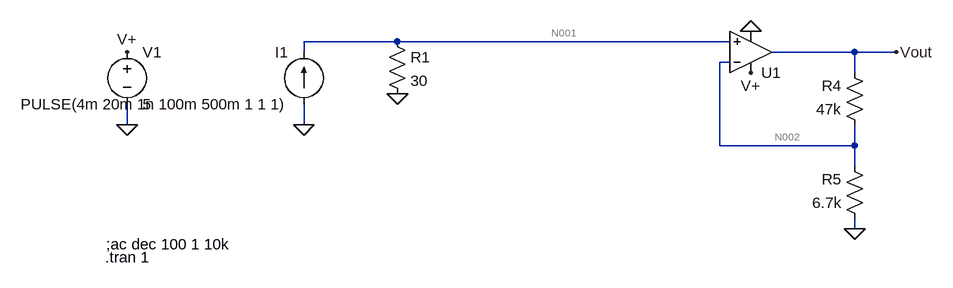
[diagram p0: schematic PT_sim.asc]
PT_sim.asc, the LTspice schematic file:
Version 4
SHEET 1 880 680
WIRE 32 112 -112 112
WIRE 544 112 32 112
WIRE -112 128 -112 112
WIRE 736 128 608 128
WIRE 800 128 736 128
WIRE 544 144 528 144
WIRE 736 160 736 128
WIRE -384 240 -384 208
WIRE -112 240 -112 208
WIRE 528 272 528 144
WIRE 736 272 736 240
WIRE 736 272 528 272
WIRE 736 304 736 272
WIRE 736 400 736 384
FLAG 736 400 0
FLAG 800 128 Vout
FLAG -112 240 0
FLAG -384 240 0
FLAG -384 128 V+
FLAG 576 160 V+
FLAG 576 96 0
FLAG 32 192 0
SYMBOL res 752 256 R180
WINDOW 0 36 76 Left 2
WINDOW 3 36 40 Left 2
SYMATTR InstName R4
SYMATTR Value 47k
SYMBOL res 752 400 R180
WINDOW 0 36 76 Left 2
WINDOW 3 36 40 Left 2
SYMATTR InstName R5
SYMATTR Value 6.7k
SYMBOL OpAmps\\UniversalOpAmp2 576 128 M180
SYMATTR InstName U1
SYMBOL voltage -384 112 R0
WINDOW 123 0 0 Left 0
WINDOW 39 0 0 Left 0
SYMATTR InstName V1
SYMATTR Value 5
SYMBOL current -112 208 R180
WINDOW 0 24 80 Left 2
WINDOW 3 24 0 Left 2
WINDOW 123 0 0 Left 0
WINDOW 39 0 0 Left 0
SYMATTR InstName I1
SYMATTR Value PULSE(4m 20m 1n 100m 500m 1 1 1)
SYMBOL res 16 96 R0
SYMATTR InstName R1
SYMATTR Value 30
TEXT -416 424 Left 2 !;ac dec 100 1 10k
TEXT -418 444 Left 2 !.tran 1

The netlist it stands for:
* PT_sim.asc
R4 N002 Vout 47k
R5 0 N002 6.7k
XU1 N001 N002 V+ 0 Vout level2 Avol=1Meg GBW=10Meg Slew=10Meg Ilimit=25m Rail=0 Vos=0 En=0 Enk=0 In=0 Ink=0 Rin=500Meg  ; pins In+ In- V+ V- OUT
V1 V+ 0 5
I1 0 N001 PULSE(4m 20m 1n 100m 500m 1 1 1)
R1 N001 0 30
;ac dec 100 1 10k
.tran 1
.lib UniversalOpAmp2.lib
.backanno
.end

* Results of the author's LTspice run, read from the files saved beside the schematic
* Operating Point, zero values left out:
*   V(n002) = 120 mV
*   V(vout) = 961.6 mV
*   V(v+) = 5 V
*   V(n001) = 120 mV
*   I(I1) = 4 mA
*   I(R4) = -17.91 µA
*   I(R5) = -17.91 µA
*   I(R1) = 4 mA
*   I(V1) = -206.2 µA
*   Ix(u1:1) = -4.76 nA
*   Ix(u1:2) = -4.76 nA
*   Ix(u1:3) = 206.2 µA
*   Ix(u1:4) = -188.3 µA
*   Ix(u1:5) = -17.91 µA
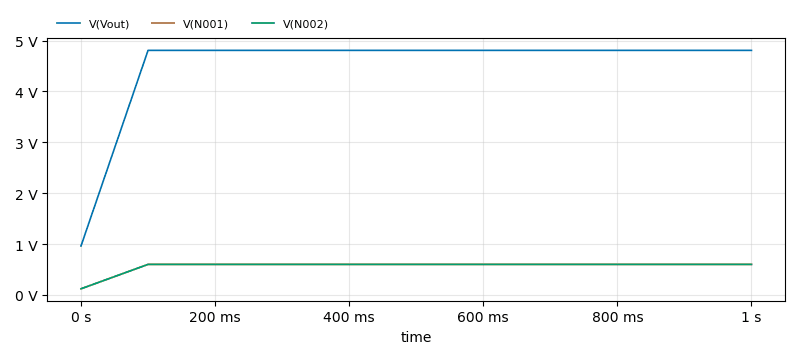
[diagram p1: Transient Analysis of PT_sim.asc, plotted from the saved traces]
* Transient Analysis, 1 run:
*   V(Vout): min 961.6 mV, max 4.809 V, average 4.616 V, rms 4.666 V, last 4.809 V
*   V(N001): min 120 mV, max 600 mV, average 576 mV, rms 582.2 mV, last 600 mV
*   V(N002): min 120 mV, max 600 mV, average 576 mV, rms 582.2 mV, last 600 mV